# EAGLE board 8ModuleBoard_vr2 (EAGLE 6.3)
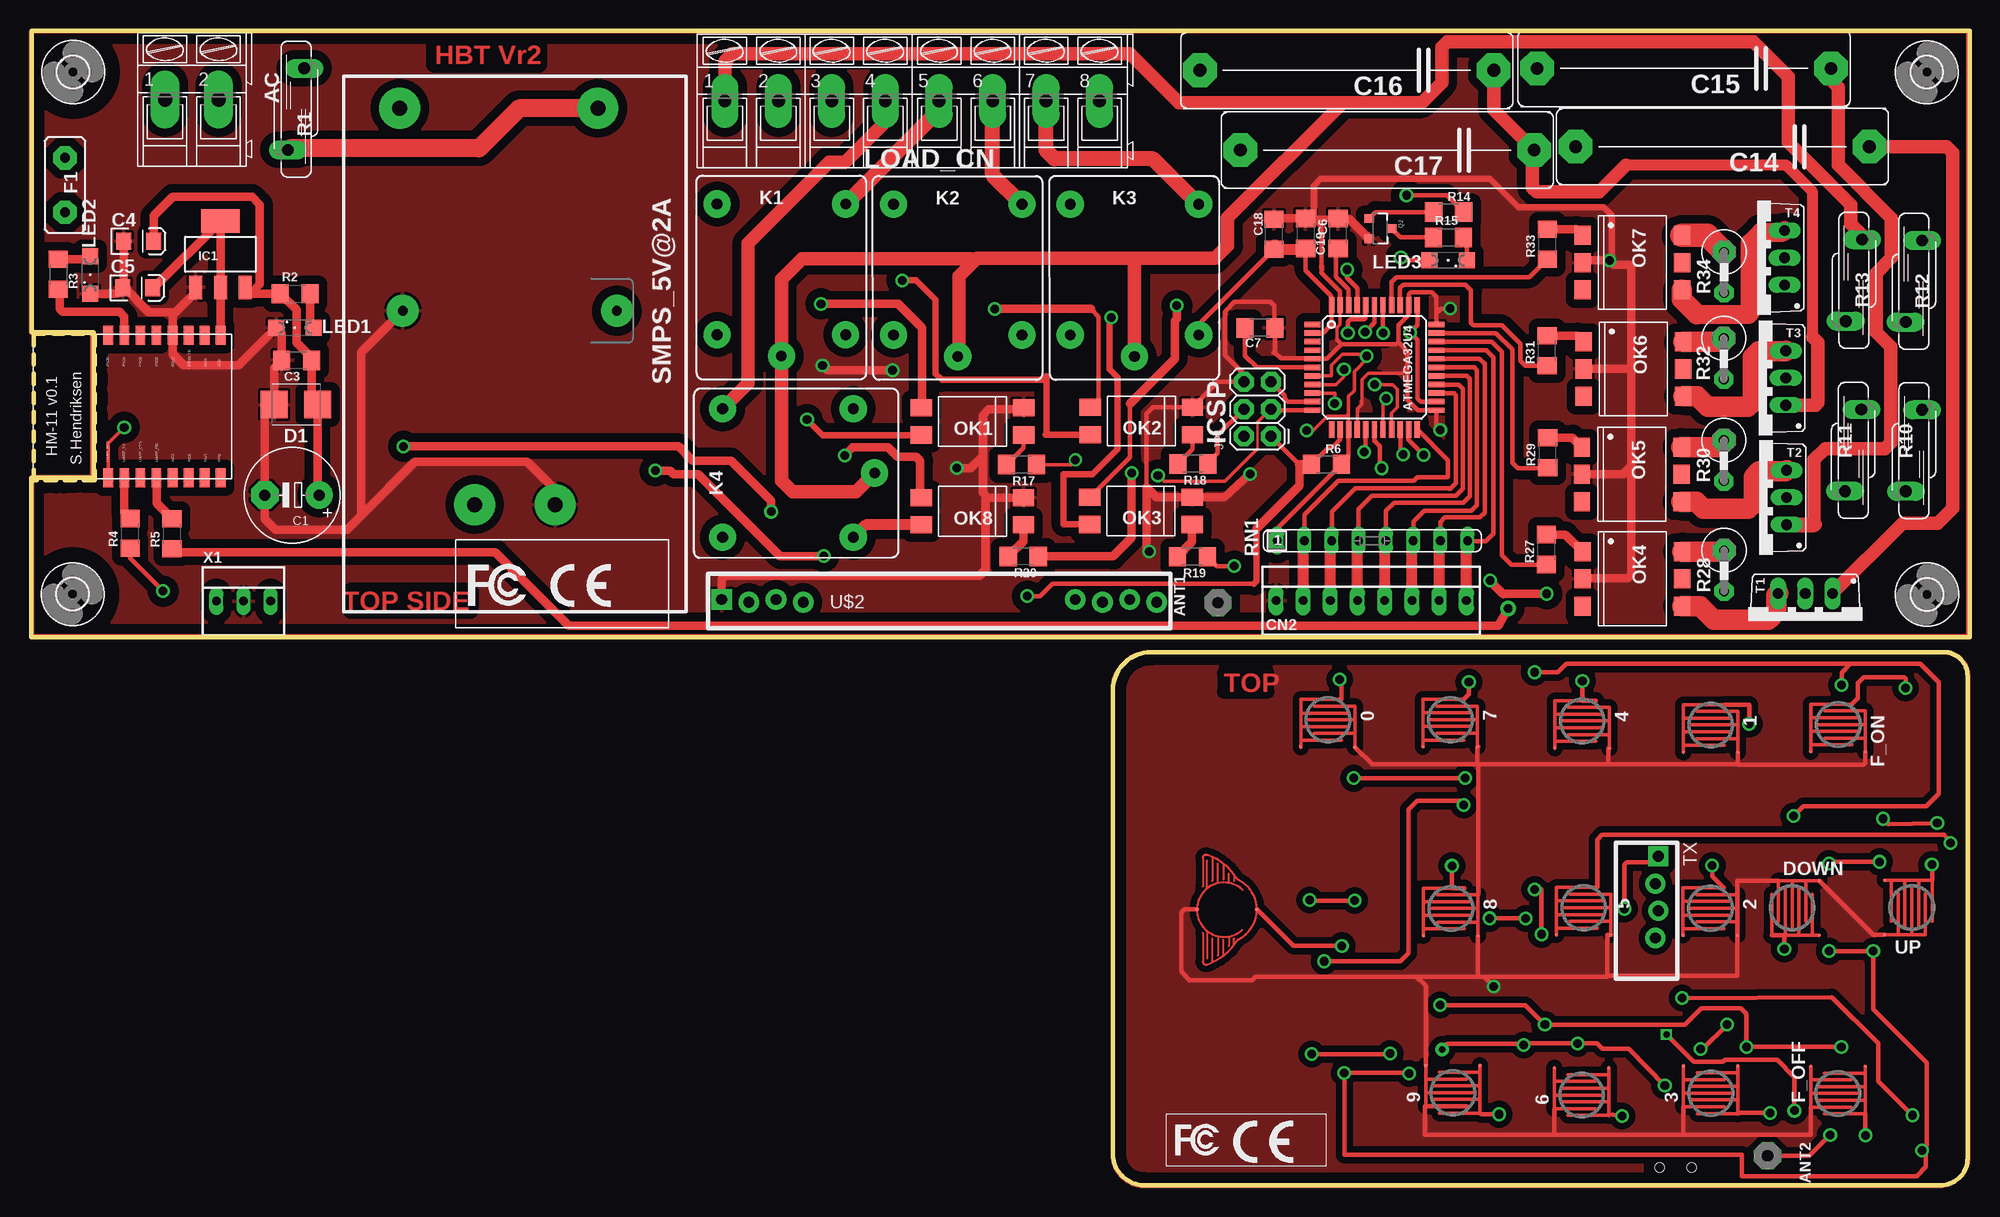
[diagram p5: board, top side]
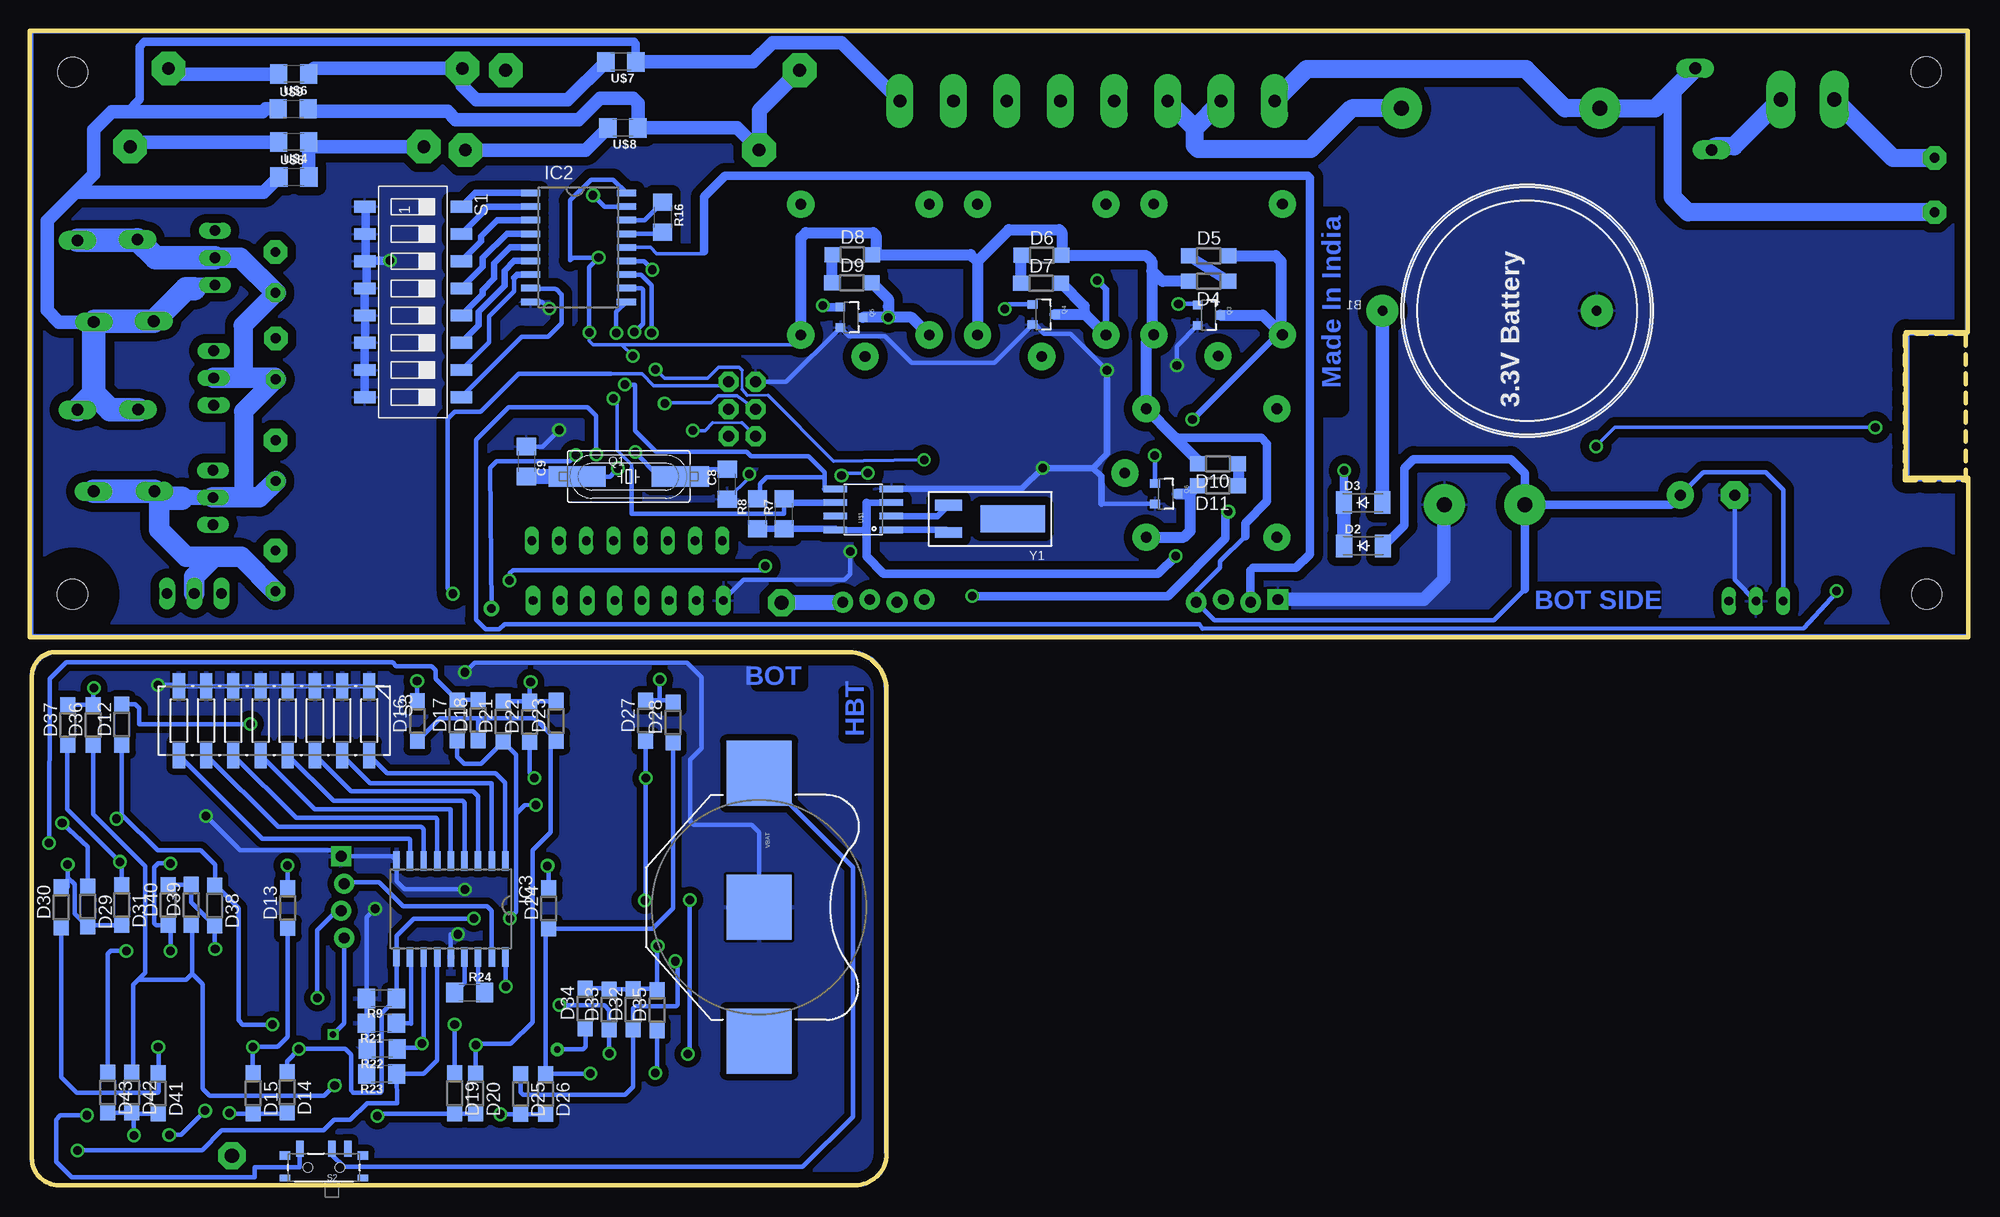
[diagram p6: board, bottom side, seen from below]

Size 180.99 x 107.79 mm. Coordinates in mm from the lower left corner, seen from the top.
Outline: 5.91,79.34 5.91,65.83 0.22,65.79 0.22,79.49 5.83,79.49
Outline: 0.06,107.79 180.99,107.79 180.99,51.15 0,51.15 0,66.04 5.81,66.04 5.81,79.64 0.02,79.64 0.02,107.77
Outline: 178.53,49.75 104.54,49.75 arc90 100.99,46.21 100.99,2.93 arc90 103.93,0 178.3,0 arc90 180.81,2.51 180.81,47.54 arc90 178.58,49.77
Copper layers (1*16): Top 0.035mm / dielectric 1.5mm / Bottom 0.035mm
Design rules "default": minimum track width 10mil, minimum drill 24mil, track to track 8mil, track to pad 8mil, pad to pad 8mil, via to via 8mil, smd to smd 8mil, copper to edge 40mil, drill to drill 8mil, minimum pad ring 10mil, minimum via ring 8mil, stop-mask expansion 4mil, vias tented up to drill 0mil, thermal gap 10mil

## Footprints (pad centres in the part's own frame; a part is rotated, then mirrored left to right if it is on the bottom)
BUTTON-CONDUCTIVE = smd 0.203 x 0.203: 1 2.54,2.54; 2 2.54,-2.54
AK300/2 = drill 1.321 pad 2.7 long: 1 -2.515,0; 2 2.489,0
PAD-01 = drill 1.321 pad 2.54 octagon: 1 0,0
TQFP44 = smd 1.5 x 0.5: 1 -5.8,4; 2 -5.8,3.2; 3 -5.8,2.4; 4 -5.8,1.6; 5 -5.8,0.8; 6 -5.8,0; 7 -5.8,-0.8; 8 -5.8,-1.6; 9 -5.8,-2.4; 10 -5.8,-3.2; 11 -5.8,-4; 23 5.8,-4; 24 5.8,-3.2; 25 5.8,-2.4; 26 5.8,-1.6; 27 5.8,-0.8; 28 5.8,0; 29 5.8,0.8; 30 5.8,1.6; 31 5.8,2.4; 32 5.8,3.2; 33 5.8,4 | smd 0.5 x 1.5: 12 -4,-5.8; 13 -3.2,-5.8; 14 -2.4,-5.8; 15 -1.6,-5.8; 16 -0.8,-5.8; 17 0,-5.8; 18 0.8,-5.8; 19 1.6,-5.8; 20 2.4,-5.8; 21 3.2,-5.8; 22 4,-5.8; 34 4,5.8; 35 3.2,5.8; 36 2.4,5.8; 37 1.6,5.8; 38 0.8,5.8; 39 0,5.8; 40 -0.8,5.8; 41 -1.6,5.8; 42 -2.4,5.8; 43 -3.2,5.8; 44 -4,5.8
CR2032 = drill 0.9 pad 3: + 10,0; - -10,0
E5-8,5 = drill 1.016 pad 2.54: + -2.54,0 | drill 1.016 pad 2.54 octagon: - 2.54,0
1206 = smd 1.6 x 1.8: 1 -1.4,0; 2 1.4,0
EIA3216 = smd 1.4 x 1.6: A 1.4,0; C -1.4,0
C27.5B9 = drill 1.194 pad 3.15 octagon: 1 -13.716,0; 2 13.716,0
22-23-2081 = drill 0.8 pad 1.422 long: 1 -8.89,0; 2 -6.35,0; 3 -3.81,0; 4 -1.27,0; 5 1.27,0; 6 3.81,0; 7 6.35,0; 8 8.89,0
SMBJ = smd 2.54 x 2.54: A 2.04,0; C -2.03,0
SOD-123_MINI-SMA = smd 1.5 x 2.1: A 1.8,0; C -1.8,0
SOD123 = smd 1.4 x 1.4: A 1.9,0; C -1.9,0
MF-5,1B = drill 0.914 pad 2.184 octagon: 1 -2.54,0; 2 2.54,0
2,8 = hole 2.8: 0,0
SOT223 = smd 1.219 x 2.235: 1 -2.311,-3.099; 2 0,-3.099; 3 2.311,-3.099 | smd 3.6 x 2.2: 4 0,3.099
SOP18 = smd 0.6 x 1.8: 1 -5.08,-4.475; 2 -3.81,-4.475; 3 -2.54,-4.475; 4 -1.27,-4.475; 5 0,-4.475; 6 1.27,-4.475; 7 2.54,-4.475; 8 3.81,-4.475; 9 5.08,-4.475; 10 5.08,4.475; 11 3.81,4.5; 12 2.54,4.5; 13 1.27,4.5; 14 0,4.5; 15 -1.27,4.5; 16 -2.54,4.5; 17 -3.81,4.5; 18 -5.08,4.5
2X3 = drill 1.016 pad 1.88 octagon: 1 0,0; 2 0,2.54; 3 2.54,0; 4 2.54,2.54; 5 5.08,0; 6 5.08,2.54
JS-M = drill 1 pad 2.54: 1 6.7,6; 2 6.7,-6; C 8.7,0; NC -5.5,-6; NO -5.5,6
SML1206 = smd 1.5 x 1.5: A 1.75,0; C -1.75,0
AK300/8 = drill 1.2 pad 2.54 long: 1 -17.501,0; 2 -12.497,0; 3 -7.518,0; 4 -2.515,0; 5 2.515,0; 6 7.518,0; 7 12.497,0; 8 17.501,0
BUTTON-CONDUCTIVE-MINI = smd 0.254 x 0.254: 1 5.08,-0.559; 2 5.08,5.055
DIL4-SMD = smd 1.6 x 2: 1 -1.27,-4.77; 2 1.27,-4.77; 3 1.27,4.77; 4 -1.27,4.77
DIL6-SMD = smd 1.78 x 1.52: 1 -2.54,-4.645; 2 0,-4.645; 3 2.54,-4.645; 4 2.54,4.645; 5 0,4.645; 6 -2.54,4.645
HC49UP = smd 5.334 x 1.93: 1 -4.826,0; 2 4.826,0
SOT23-3 = smd 0.8 x 0.9: 1 -0.95,-1; 2 0.95,-1; 3 0,1.1
S10K11 = drill 1.1 pad 1.778 long: 1 -0.762,-3.81; 2 0.762,3.81
0411V = drill 0.914 pad 2.184 octagon: 1 -2.54,0 | drill 0.914 pad 1.778 octagon: 2 1.27,0
SIL8 = drill 0.813 long: 1 -8.89,0; 2 -6.35,0; 3 -3.81,0; 4 -1.27,0; 5 1.27,0; 6 3.81,0; 7 6.35,0; 8 8.89,0
SMS-008 = smd 1.092 x 2.007: 1 -8.89,-4.496; 2 -6.35,-4.496; 3 -3.81,-4.496; 4 -1.27,-4.496; 5 1.27,-4.496; 6 3.81,-4.496; 7 6.35,-4.496; 8 8.89,-4.496; 9 8.89,4.496; 10 6.35,4.496; 11 3.81,4.496; 12 1.27,4.496; 13 -1.27,4.496; 14 -3.81,4.496; 15 -6.35,4.496; 16 -8.89,4.496
SWITCH-SPST-SMD-A = smd 0.7 x 1.5: 1 -2.25,-1.75; 2 -0.75,-1.75; 3 2.25,-1.75 | smd 1 x 0.6: GND1 -3.65,1; GND3 3.65,1 | smd 1 x 0.8: GND2 -3.65,-1.1; GND4 3.65,-1.1 | hole 0.9: -1.5,0; 1.5,0
CTS-219-08J = smd 1.13 x 2.44: 1 -8.89,-3.215; 2 -6.35,-3.215; 3 -3.81,-3.215; 4 -1.27,-3.215; 5 1.27,-3.215; 6 3.81,-3.215; 7 6.35,-3.215; 8 8.89,-3.215; 9 8.89,3.215; 10 6.35,3.215; 11 3.81,3.215; 12 1.27,3.215; 13 -1.27,3.215; 14 -3.81,3.215; 15 -6.35,3.215; 16 -8.89,3.215
MKS1854-6-0-404 = drill 1.4 pad 3.81: 1 5.25,47; 2 23.75,47; 3 12.25,10; 4 19.75,10
TO220BV = drill 1 pad 1.422 long: G 2.54,-2.54; T1 -2.54,-2.54; T2 0,-2.54
RF-LINK_TX = drill 1.016 pad 1.88: ANT 7.62,-0.127; DATA 2.54,-0.127; VCC 5.08,0.127 | drill 1.016 pad 1.88 square: GND 0,0.127
SO08 = smd 0.61 x 2.21: 1 -1.905,-2.616; 2 -0.635,-2.616; 3 0.635,-2.616; 4 1.905,-2.616; 5 1.905,2.616; 6 0.635,2.616; 7 -0.635,2.616; 8 -1.905,2.616
RF-LINK_RX = drill 1 pad 1.93: +5V@1 7.62,-0.127; +5V@2 33.02,0.127; ANT 40.64,-0.127; DATA@1 2.54,-0.127; DATA@2 5.08,0.127; GND@2 35.56,-0.127; GND@3 38.1,0.127 | drill 1 pad 1.93 square: GND@1 0,0.127
HM-11 = smd 1.778 x 0.914: GND 7.508,-0.6; NC1 -5.808,-0.6; NC2 -5.808,-2.1; NC3 7.508,-3.6; NV1 -5.808,-3.6; NV2 -5.808,-5.1; PIO0 7.508,5.4; PIO1 7.508,3.9; PIO2 7.508,2.4; PIO3 7.508,0.9; RESETB 7.508,-2.1; UART_CTS -5.808,2.4; UART_RTS -5.808,5.4; UART_RX -5.808,0.9; UART_TX -5.808,3.9; VCC 7.508,-5.1
BATTCON_20MM = smd 6.07 x 6.07: 1 -12.5,0; 2 0,0; 3 12.5,0
22-23-2031 = drill 0.8 pad 1.27 long: 1 -2.54,0; 2 0,0; 3 2.54,0
CRYSTAL_CYL_2X6MM_SMT = smd 2.5 x 1: 1 2.125,1.27; 2 2.125,-1.27 | smd 6 x 2.5: CYLINDER -3.875,0

## Placement (x,y rotation side)
0  BUTTON-CONDUCTIVESMD  [BUTTON-CONDUCTIVE]  121.07,43.45 270 top
1  BUTTON-CONDUCTIVESMD  [BUTTON-CONDUCTIVE]  156.8,42.97 270 top
2  BUTTON-CONDUCTIVESMD  [BUTTON-CONDUCTIVE]  156.77,25.86 270 top
3  BUTTON-CONDUCTIVESMD  [BUTTON-CONDUCTIVE]  156.82,8.59 90 top
4  BUTTON-CONDUCTIVESMD  [BUTTON-CONDUCTIVE]  144.82,43.34 270 top
5  BUTTON-CONDUCTIVESMD  [BUTTON-CONDUCTIVE]  144.95,25.9 270 top
6  BUTTON-CONDUCTIVESMD  [BUTTON-CONDUCTIVE]  144.76,8.41 90 top
7  BUTTON-CONDUCTIVESMD  [BUTTON-CONDUCTIVE]  132.5,43.46 270 top
8  BUTTON-CONDUCTIVESMD  [BUTTON-CONDUCTIVE]  132.54,25.84 270 top
9  BUTTON-CONDUCTIVESMD  [BUTTON-CONDUCTIVE]  132.75,8.64 90 top
AC  [AK300/2]  14.99,101.36 0 top
ANT1  [PAD-01]  110.81,54.38 90 top
ANT2  [PAD-01]  162.12,2.74 270 top
ATMEGA32U4  ATMEGA32U4TQFP-44  [TQFP44]  125.41,76.35 0 top
B1  [CR2032]  44.68,81.64 0 top
C1  470uF/25V  [E5-8,5]  24.34,64.43 180 top
C3  0.1uF  [1206]  24.76,77 180 top
C4  10uF  [EIA3216]  10,88.12 0 top
C5  10uF  [EIA3216]  9.92,83.77 0 top
C6  0.1uF  [1206]  122.03,88.85 90 top
C7  1uF  [1206]  114.71,80.03 180 top
C8  18pF  [1206]  115.87,65.45 90 bottom
C9  18pF  [1206]  134.64,67.56 270 bottom
C14  2.2uF/250VAC  [C27.5B9]  157.92,96.96 180 top
C15  3.3uF/250VAC  [C27.5B9]  154.33,104.26 180 top
C16  2.2uF/250VAC  [C27.5B9]  122.84,104.09 180 top
C17  3.3uF/250VAC  [C27.5B9]  126.62,96.64 180 top
C18  0.1uF  [1206]  116.02,88.77 90 top
C19  0.1uF  [1206]  118.98,88.85 270 top
CN2  Capsense I/P  [22-23-2081]  125.11,54.58 0 top
D1  [SMBJ]  24.72,72.88 180 top
D2  CGRM4007-G  [SOD-123_MINI-SMA]  56.46,59.69 0 bottom
D3  CGRM4007-G  [SOD-123_MINI-SMA]  56.51,63.73 0 bottom
D4  [SOD123]  70.92,84.38 180 bottom
D5  [SOD123]  70.92,86.79 0 bottom
D6  [SOD123]  86.52,86.81 0 bottom
D7  [SOD123]  86.57,84.2 0 bottom
D8  [SOD123]  104.2,86.88 0 bottom
D9  [SOD123]  104.24,84.24 0 bottom
D10  [SOD123]  70.05,67.37 180 bottom
D11  [SOD123]  70.06,65.3 180 bottom
D12  [SOD123]  172.4,42.99 90 bottom
D13  [SOD123]  156.91,25.87 90 bottom
D14  [SOD123]  156.99,8.68 270 bottom
D15  [SOD123]  160.13,8.59 270 bottom
D16  [SOD123]  144.81,43.35 90 bottom
D17  [SOD123]  141.1,43.38 90 bottom
D18  [SOD123]  139.13,43.41 90 bottom
D19  [SOD123]  141.34,8.58 270 bottom
D20  [SOD123]  139.35,8.56 270 bottom
D21  [SOD123]  136.79,43.29 90 bottom
D22  [SOD123]  134.34,43.26 90 bottom
D23  [SOD123]  131.85,43.35 90 bottom
D24  [SOD123]  132.53,25.85 90 bottom
D25  [SOD123]  135.19,8.51 270 bottom
D26  [SOD123]  132.85,8.52 270 bottom
D27  [SOD123]  123.5,43.37 90 bottom
D28  [SOD123]  120.95,43.2 90 bottom
D29  [SOD123]  175.59,26.02 270 bottom
D30  [SOD123]  178.06,25.95 90 bottom
D31  [SOD123]  172.42,26.16 270 bottom
D32  [SOD123]  124.66,16.42 90 bottom
D33  [SOD123]  126.89,16.4 90 bottom
D34  [SOD123]  129.16,16.49 90 bottom
D35  [SOD123]  122.44,16.34 90 bottom
D36  [SOD123]  175.09,42.95 90 bottom
D37  [SOD123]  177.44,42.95 90 bottom
D38  [SOD123]  163.74,26.12 270 bottom
D39  [SOD123]  165.95,26.17 90 bottom
D40  [SOD123]  168.07,26.15 90 bottom
D41  [SOD123]  168.99,8.58 270 bottom
D42  [SOD123]  171.47,8.67 270 bottom
D43  [SOD123]  173.71,8.67 270 bottom
DOWN  BUTTON-CONDUCTIVESMD  [BUTTON-CONDUCTIVE]  164.42,25.89 0 top
F1  PFUSE 1A  [MF-5,1B]  3.13,93.37 90 top
F_OFF  BUTTON-CONDUCTIVESMD  [BUTTON-CONDUCTIVE]  168.69,8.56 90 top
F_ON  BUTTON-CONDUCTIVESMD  [BUTTON-CONDUCTIVE]  168.72,43.01 270 top
H1  MOUNT-HOLE2.8  [2,8]  3.89,103.93 0 top
H2  MOUNT-HOLE2.8  [2,8]  3.85,55.18 0 top
H3  MOUNT-HOLE2.8  [2,8]  177,103.91 0 top
H4  MOUNT-HOLE2.8  [2,8]  177.02,55.15 0 top
IC1  [SOT223]  17.66,86.91 0 top
IC2  HT680D  [SOP18]  129.77,87.55 270 bottom
IC3  HT680D  [SOP18]  141.68,25.8 180 bottom
JP1  AVR_SPI_PRG_6PTH  [2X3]  115.76,69.92 90 top
K1  JS-M1-9V-4  [JS-M]  70.04,86.1 270 top
K2  JS-M1-9V-4  [JS-M]  86.5,86.07 270 top
K3  JS-M1-9V-4  [JS-M]  103,86.07 270 top
K4  JS-M1-9V-4  [JS-M]  70.05,66.49 0 top
LED1  [SML1206]  24.6,80.05 0 top
LED2  [SML1206]  5.49,84.99 90 top
LED3  [SML1206]  132.3,86.34 180 top
LOAD_CN  [AK300/8]  82.25,101.22 0 top
MASTER  BUTTON-CONDUCTIVE  [BUTTON-CONDUCTIVE-MINI]  109.4,30.83 270 top
OK1  PC817DIL4  [DIL4-SMD]  87.88,71.3 90 top
OK2  PC817DIL4  [DIL4-SMD]  103.65,71.35 90 top
OK3  PC817DIL4  [DIL4-SMD]  103.61,62.96 90 top
OK4  MOC3031S  [DIL6-SMD]  149.51,56.6 270 top
OK5  MOC3031S  [DIL6-SMD]  149.44,66.36 270 top
OK6  MOC3031S  [DIL6-SMD]  149.6,76.2 270 top
OK7  MOC3031S  [DIL6-SMD]  149.49,86.13 270 top
OK8  PC817DIL4  [DIL4-SMD]  87.87,62.92 90 top
Q1  16MHz  [HC49UP]  125.08,66.16 0 bottom
Q2  MMBT2222A  [SOT23-3]  125.92,89.31 270 top
Q3  MMBT2222A  [SOT23-3]  70.95,81.22 270 bottom
Q4  MMBT2222A  [SOT23-3]  86.37,81.29 270 bottom
Q5  MMBT2222A  [SOT23-3]  104.31,81.02 270 bottom
Q6  MMBT2222A  [SOT23-3]  74.93,64.55 270 bottom
R1  MOV300V  [S10K11]  24.72,100.46 0 top
R2  1K  [1206]  24.64,83.22 0 top
R3  1K  [1206]  2.51,85.03 270 top
R4  1K  [1206]  9.22,60.85 90 top
R5  1K  [1206]  13.13,60.81 90 top
R6  10K  [1206]  120.94,67.31 0 top
R7  4k7  [1206]  110.57,62.69 90 bottom
R8  4k7  [1206]  113.04,62.69 90 bottom
R9  1K  [1206]  148.17,17.43 180 bottom
R10  S10K11  [S10K11]  175.8,68.58 180 top
R11  S10K11  [S10K11]  170.13,68.6 180 top
R12  S10K11  [S10K11]  175.79,84.39 0 top
R13  S10K11  [S10K11]  170.19,84.48 0 top
R14  10K  [1206]  132.35,90.85 0 top
R15  560R  [1206]  132.33,88.49 0 top
R16  33k  [1206]  121.91,90.36 270 bottom
R17  1K  [1206]  92.46,67.27 180 top
R18  1K  [1206]  108.46,67.34 180 top
R19  1K  [1206]  108.41,58.67 180 top
R20  1K  [1206]  92.61,58.7 180 top
R21  1K  [1206]  148.16,15.11 180 bottom
R22  1K  [1206]  148.11,12.72 180 bottom
R23  1K  [1206]  148.14,10.38 180 bottom
R24  750K  [1206]  139.93,17.99 0 bottom
R27  560R  [1206]  141.48,59.34 90 top
R28  470R/0.5W  [0411V]  158.07,56.72 270 top
R29  560R  [1206]  141.59,68.39 90 top
R30  470R/0.5W  [0411V]  158.05,67.01 270 top
R31  560R  [1206]  141.53,77.91 90 top
R32  470R/0.5W  [0411V]  158.03,76.52 270 top
R33  560R  [1206]  141.57,87.86 90 top
R34  470R/0.5W  [0411V]  158.06,84.58 270 top
RN1  [SIL8]  125.22,60.17 0 top
S1  SWS008  [SMS-008]  145.22,82.45 270 bottom
S2  [SWITCH-SPST-SMD-A]  153.54,1.65 180 bottom
S3  219-08J  [CTS-219-08J]  158.19,43.37 180 bottom
SMPS_5V@2A  5V@2A  [MKS1854-6-0-404]  29.15,53.54 0 top
T1  BTB16-V  [TO220BV]  165.65,52.71 180 top
T2  BTB16-V  [TO220BV]  161.36,64.2 90 top
T3  BTB16-V  [TO220BV]  161.29,75.36 90 top
T4  BTB16-V  [TO220BV]  161.18,86.58 90 top
TX  RF-LINK_TX  [RF-LINK_TX]  151.79,30.7 270 top
U$1  DS1307SO8  [SO08]  103.16,63.09 90 bottom
U$2  RF-LINK_RX  [RF-LINK_RX]  64.46,54.55 0 top
U$3  HM-11  [HM-11]  12.58,71.85 90 top
U$4  220K  [1206]  156.37,97.39 180 bottom
U$5  2E2  [1206]  156.34,94.14 0 bottom
U$6  220K  [1206]  156.35,103.74 180 bottom
U$7  2E2  [1206]  125.81,104.87 180 bottom
U$8  220K  [1206]  125.62,98.7 180 bottom
U$9  2E2  [1206]  156.4,100.5 0 bottom
U$10  [CE-4MM]  112.22,2.03 0 top
U$11  [FCC_6.1X15MM]  105.92,1.71 0 top
U$12  [FCC_20X8.35MM]  39.57,52 0 top
U$13  [CE-4MM]  48.46,53.96 0 top
UP  BUTTON-CONDUCTIVESMD  [BUTTON-CONDUCTIVE]  175.59,25.92 180 top
VBAT  [BATTCON_20MM]  112.9,25.95 270 bottom
X1  22-23-2031  [22-23-2031]  19.8,54.52 0 top
Y1  32.768KHz  [CRYSTAL_CYL_2X6MM_SMT]  93.08,62.21 180 bottom

## Tracks (layer width: path | path; a pad name or v marks a point on that pad's centre or on a via)
!RESET  (via drill 0.8 pad 1.27)
  Top 0.305: 115.75,69.9 118.43,67.22 | v8.66,70.74 7.18,69.26 U$3.UART_RTS
  Top 0.406: 115.75,69.9 JP1.1 118.38,67.31 | ATMEGA32U4.13 122.21,69.59 121.57,68.96 121.19,68.96 R6.1 | 114.18,56.17 95.36,56.17 94.19,55 v93,55
  Top 0.61: 114.4,61.28 114.4,56.39 114.18,56.17
  Top 0.813: R6.1 118.38,67.31 | 118.43,67.22 118.43,65.31 114.4,61.28 | v34.75,68.97 60.45,68.97 61.76,67.66 65.32,67.66 69.07,63.9 v69.07,62.88
  Bottom 0.305: v34.75,68.97 32.97,70.74 v8.66,70.74
  Bottom 0.813: v93,55 77.97,55 74.73,55 69.34,60.39 69.34,62.61 v69.07,62.88
(DIN)TE
  Bottom 0.305: IC2.14 123.06,87.55 122.48,86.98 118.23,86.98 118.05,87.17 | 61.63,94.24 61.46,94.07 | 66.8,57.63 67.02,57.41 | 67.02,54.45 U$2.DATA@1
  Bottom 0.813: 118.05,87.17 118.05,92.27 116.07,94.24 61.63,94.24 | 61.46,94.07 61.46,58.92 62.75,57.63 66.8,57.63 | 67.02,57.41 67.02,54.45
(VT)ADOUT  (via drill 0.8 pad 1.27)
  Top 0.406: R14.2 132.18,92.42 v128.41,92.42
  Bottom 0.406: v128.41,92.42 127.35,91.36 IC2.17
+3V3
  Top 0.813: U$3.VCC 17.66,79.38 IC1.2 IC1.4 11.43,83.77 C5.A
+5V  (via drill 0.8 pad 1.27)
  Top 0.305: ATMEGA32U4.7 121.39,75.55 121.39,76.56 122.41,77.58 124.54,77.58 v124.68,77.43 124.83,77.29 124.87,77.29 123.55,75.96 123.55,74.18 123.01,73.64 123.01,71.05 123.01,71.06 123.01,72 122.81,71.8 121.02,71.8 119.66,70.44 v119.1,70.44
  Top 0.406: 131.4,73.21 131.35,73.15 ATMEGA32U4.24 129.73,73.15 129.44,73.45 129.44,78.95 v128.76,79.62 129.41,80.27 ATMEGA32U4.34 | v127.89,86.6 128.15,86.34 LED3.A | C19.2 118.98,85.42 121.41,82.99 ATMEGA32U4.44 121.41,80.36 120.6,79.55 ATMEGA32U4.2 | RN1.1 116.33,61.3 R6.2 123.01,67.97 ATMEGA32U4.14 123.01,71.05 | C18.1 109,80.35 K3.1
  Top 0.813: 20.5,83.28 20.56,83.22 R2.1 24.75,81.71 24.75,78.65 26.16,77.24 C3.1 26.16,73.47 D1.C 26.75,64.56 C1.+ | 20.5,83.28 IC1.3 | C4.A 11.4,90.48 13.18,92.26 20.61,92.26 21.33,91.54 21.33,84.11 20.5,83.28
  Top 1.016: C18.1 118.9,87.37 C19.2
  Top 1.27: C18.1 116.13,87.48 116.13,87.67
  Bottom 0.254: 114.54,71.2 117.23,71.2
  Bottom 0.305: K3.1 109.67,78.71 arc90 109.9,78.47 125.73,78.47 | v128.76,79.62 128.76,78.83 128.41,78.47 125.73,78.47 | JP1.2 114.49,71.2 114.54,71.2 | 117.23,71.2 117.94,70.44 v119.1,70.44 | 125.73,78.47 v124.68,77.43
  Bottom 0.406: IC2.18 126.52,93.88 128.6,93.88 130.55,91.93 LED3.A 130.29,86.6 v127.89,86.6 128.76,85.72 v128.76,79.62 | X1.1 17.26,64.94 18.9,66.58 24.73,66.58 C1.+ | 41.4,55.63 44.3,52.73 70.38,52.73 U$2.+5V@1 72.08,55.44 69.87,57.64 69.87,58.23 67.51,60.6
  Bottom 0.61: D2.A 54.54,59.81 54.45,59.81
  Bottom 0.813: 41.4,55.63 SMPS_5V@2A.3 | 54.45,59.81 52.63,61.62 52.63,66.94 51.79,67.79 42.7,67.79 41.4,66.48 SMPS_5V@2A.3 | 74.05,69.79 66.01,69.79 65.45,69.24 65.45,63.85 67.51,61.79 67.51,60.6 | C1.+ 27.77,63.54 SMPS_5V@2A.3
  Bottom 1.016: D10.A 71.95,67.7 74.05,69.79 K4.1 76.75,78.7 K1.1 76.21,79.58 76.21,85.36 | D8.A 101.78,86.88 | K3.1 109,88.46 108.54,88.93 102.23,88.93 102,88.7 102,87.11 101.78,86.88 | 76.21,85.36 76.21,86.24 76.79,86.81 D6.A 84.62,88.97 84.87,89.21 89.58,89.21 92.53,86.27 | 101.78,86.88 93.14,86.88 92.53,86.27 | 92.53,86.27 92.53,79.39 K2.1 | D4.A 75.23,84.38 76.21,85.36
A0
  Bottom 0.61: IC2.1 139.43,92.63 S1.16
A1
  Bottom 0.61: IC2.2 138.27,91.36 138.87,90.76 138.87,90.66 S1.15
A2
  Bottom 0.61: IC2.3 137.34,90.09 138.85,88.58 138.85,88.13 S1.14
A3
  Bottom 0.61: IC2.4 136.44,88.82 138.69,86.57 138.69,85.75 S1.13
A4
  Bottom 0.61: IC2.5 136.14,87.55 137.64,86.06 137.64,84.65 138.73,83.56 138.73,83.17 S1.12
A5
  Bottom 0.61: IC2.6 135.77,86.28 136.67,85.38 136.67,83.95 139.07,81.55 139.07,80.3 S1.11
A6
  Bottom 0.406: 135.78,84.73 135.78,83.47 138.11,81.14 138.11,78.72 S1.10
  Bottom 0.61: IC2.7 135.5,85.01 135.78,84.73
A7
  Bottom 0.406: IC2.8 134.24,83.68 134.24,83.67 131.95,83.67 131.9,83.63 131.83,83.63 131.39,83.19 131.36,83.19 131.36,80.47 132.61,79.21 135.07,79.21 S1.9
BLE_STATUS
  Top 0.813: U$3.PIO1 8.68,81.09 8.25,81.52 2.93,81.52 2.64,81.81 2.64,83.5 R3.2
D8  (via drill 0.8 pad 1.27)
  Top 0.406: v126.22,79.57 v126.21,79.57 ATMEGA32U4.38
  Bottom 0.406: IC2.10 126.24,81.52 126.24,79.59 v126.22,79.57
D9  (via drill 0.8 pad 1.27)
  Top 0.406: v124.55,79.64 125.41,80.5 ATMEGA32U4.39
  Bottom 0.406: IC2.11 123.88,83.74 123.76,83.62 123.76,80.44 v124.55,79.64
D10  (via drill 0.8 pad 1.27)
  Top 0.406: v122.94,79.57 122.94,80.59 123.18,80.83 124.48,80.83 124.57,80.92 124.57,82.11 ATMEGA32U4.40
  Bottom 0.406: IC2.12 123.93,85.01 122.92,84 122.92,79.59 v122.94,79.57
D11  (via drill 0.8 pad 1.27)
  Top 0.406: v122.85,85.46 122.85,84.71 123.8,83.76 ATMEGA32U4.41
  Bottom 0.406: 125.35,86.37 IC2.13 125.16,86.28 125.13,86.25 123.64,86.25 v122.85,85.46 | 125.35,86.37
DOWN
  Top 0.406: ATMEGA32U4.29 135.24,77.15 135.71,76.68 135.71,62.79 135.27,62.35 132.02,62.35 131.58,61.91 RN1.7
  Top 1.016: CN2.7 131.46,60.07 RN1.7
EA0
  Bottom 0.406: S3.16 147.62,38.47 137.49,38.47 136.6,37.58 IC3.1
EA1
  Bottom 0.406: S3.15 149.23,37.55 137.91,37.55 137.87,37.51 IC3.2
EA2
  Bottom 0.406: S3.14 151,36.77 139.6,36.77 139.14,36.32 IC3.3
EA3
  Bottom 0.406: S3.13 152.65,35.89 140.59,35.89 140.41,35.71 IC3.4
EA4
  Bottom 0.406: S3.12 154.39,35.08 141.7,35.08 141.68,35.06 IC3.5
EA5
  Bottom 0.406: S3.11 156.14,34.3 143.07,34.3 142.95,34.18 IC3.6
EA6
  Bottom 0.406: S3.10 157.83,33.44 144.45,33.44 144.22,33.22 IC3.7
EA7
  Bottom 0.406: S3.9 159.29,32.36 145.6,32.36 145.49,32.26 IC3.8
EAD8  (via drill 0.8 pad 1.27)
  Top 0.406: v158.35,14.99 156.08,12.72 v155.86,12.72 | v136.18,24.92 139.51,24.92 v139.54,24.89 | v120.73,20.91 127.83,20.91 128.57,21.64 128.57,35.04 129.41,35.88 133.58,35.88 v133.75,35.51 | v177.97,33.8 173.42,33.69 v172.9,34.21
  Bottom 0.406: D12.C 172.4,34.59 | 172.4,34.59 169.07,31.26 165.05,31.26 163.71,29.92 163.71,28.06 | 163.71,28.06 D38.C | D25.C 135.15,10.37 135.15,8.65 134.93,8.44 125.42,8.44 124.66,9.2 D32.C 124.66,16.5 124.46,16.71 120.65,16.71 120.52,16.84 120.52,20.69 v120.73,20.91 | D17.C 141.1,40 140.44,39.34 138.85,39.34 D21.C 135.58,40.18 135.58,34.69 | 163.71,28.06 161.49,25.84 161.49,15.38 161.1,14.99 v158.35,14.99 | D14.C 156.99,11.59 v155.86,12.72 151.57,12.72 151.02,12.16 151.02,8.86 150.81,8.65 148.25,8.65 148.13,8.77 148.13,16.07 R9.1 IC3.10 146.76,23.3 145.18,24.89 v139.54,24.89 | 135.58,34.69 135.58,25.51 v136.18,24.92 | v133.75,35.51 134.81,35.47 135.58,34.69 | D29.C 175.59,31.6 v177.97,33.8 | v172.9,34.21 172.78,34.21 172.4,34.59
EAD9
  Bottom 0.406: IC3.11 arc90 145.39,21.19 145.39,15.08 arc-90 145.41,15.11 R21.1
EAD10  (via drill 0.6 pad 1.27, 0.8 pad 1.27)
  Top 0.406: v131.72,12.67 132.24,13.19 139.25,13.19 v139.35,13.08 139.51,13.24 v144.4,13.24 146.19,13.24 R22.1 149.19,12.72 v152.53,9.29
  Bottom 0.406: D36.C 175.09,34.63 170.24,29.77 170.24,19.84 170.88,19.2 | D39.C 165.86,24.18 165.86,19.73 | D42.C 171.47,10.71 171.36,10.83 171.36,18.72 170.88,19.2 | 165.86,19.73 166.39,19.2 170.88,19.2 | D20.C v139.35,13.08 139.25,13.19 136.09,13.19 134.04,15.23 134.04,31.29 132.36,32.97 132.36,40.94 D23.C 131.85,41.57 133.92,43.64 133.92,43.62 133.96,43.57 138.89,43.57 | v131.72,12.67 129.35,12.67 129.1,12.93 129.1,14.53 D34.C | 138.89,43.57 139.13,43.33 D18.C | D16.C 142.68,43.57 138.89,43.57 | IC3.12 144.22,13.41 v144.4,13.24 144.82,12.82 146.61,12.82 R22.1 | 165.86,19.73 164.87,18.74 164.87,9.01 164.2,8.35 153.52,8.35 152.18,9.69 v152.53,9.29
EAD11  (via drill 0.8 pad 1.27)
  Top 0.406: v172.59,30.19 168,30.19 v167.85,30.04 | v167.85,21.85 v172,21.85 172,16.45 177.01,11.44 177.01,3.69 176.92,3.61 | v128.66,10.42 128.6,10.49 v122.6,10.49 122.6,2.86 159.72,2.86 159.72,0.85 176.04,0.85 176.92,1.73 176.92,3.61 | v176.57,3.25 176.92,3.61
  Bottom 0.406: D37.C arc-90 177.49,41.01 177.49,35.09 v172.59,30.19 172.42,30.02 D31.C | v167.85,30.04 169.01,30.04 169.38,29.67 169.38,24.45 169.2,24.27 168.09,24.27 D40.C 167.85,24.04 v167.85,21.85 | D43.C 173.71,21.6 173.43,21.88 172.03,21.88 v172,21.85 | D35.C 122.44,10.65 v122.6,10.49 | v128.66,10.42 D26.C | D26.C | D26.C 132.85,23.63 D24.C 122.86,23.95 120.95,25.85 D28.C | IC3.13 142.95,11.68 144.22,10.4 146.71,10.4 R23.1 146.72,7.66 149.51,7.66 151.07,6.1 152.58,6.1 153.57,5.11 163.06,5.11 164.92,3.25 v176.57,3.25
EDOUT
  Bottom 0.406: IC3.17 137.87,25.61 138.32,26.06 146.15,26.06 148.36,28.28 151.54,28.28 TX.DATA
EOSC1
  Bottom 0.406: R24.2 139.14,18.6 IC3.16
EOSC2
  Bottom 0.406: R24.1 140.41,18.91 IC3.15
FAN_ON/OFF
  Top 0.406: ATMEGA32U4.30 135.88,77.95 136.52,77.31 136.52,60.8 135.84,60.12 134.17,60.12 RN1.8
  Top 1.016: CN2.8 134,60.07 RN1.8
FAN_REG
  Bottom 0.813: U$7.1 124.41,106.58 124.56,106.73 170.31,106.73 170.75,106.3 170.75,101.37 171.88,100.23
  Bottom 1.27: U$5.1 159.16,92.71 176.72,92.71 | 176.72,92.71 179.37,90.06 179.37,81.67 178.28,80.58 R12.1 | LOAD_CN.8 105.22,106.68 111.65,106.68 113.46,104.87 U$7.1 | 176.72,92.71 175.04,94.39 175.04,98.55 173.35,100.23 171.88,100.23 159.26,100.23 159,100.5 U$9.1
  Bottom 1.422: 165.63,83.68 165.27,84.04 T4.T1
  Bottom 2.184: 175.03,73.93 R12.1 174.94,80.67 R13.1 166.42,83.68 165.63,83.68 | 175.03,73.93 R10.1 | R11.1 173.51,72.41 175.03,73.93
GND  (via drill 0.8 pad 1.27)
  Top 0.305: ATMEGA32U4.43 122.21,80.35 121.92,80.07 121.92,78.92 | ATMEGA32U4.15 123.81,72.47 124.24,72.9 124.24,75.2 124.85,75.81 128.03,75.81 128.51,76.29 | 89.1,64 89.29,64.19
  Top 0.406: ATMEGA32U4.43 122.19,82.17 122.19,82.66 122.19,83.44 120.44,85.19 120.44,89.46 119.75,90.15 119.75,90.25 | ATMEGA32U4.33 131.21,81.42 | 131.21,81.42 131.21,82.94 130.78,83.37 128.82,83.37 128.64,83.19 128.64,82.18 ATMEGA32U4.35 128.61,81.22 127.65,80.26 127.65,78.71 | v132.48,81.84 131.63,81.84 131.21,81.42 | 121.92,78.92 122.34,78.5 | 122.34,78.5 127.44,78.5 127.65,78.71 | 127.65,78.71 128.51,77.85 128.51,76.29 128.51,73.32 129.48,72.35 ATMEGA32U4.23 131.21,70.85 v131.57,70.49 | 122.34,78.5 120.99,77.15 ATMEGA32U4.5 119.58,77.18 116.66,77.18 116.11,77.73 | 116.11,77.73 C7.1 116.1,80.05 116.1,82.09 115.72,82.47 112.34,82.47 111.44,81.57 111.44,77.47 113.23,75.69 JP1.6 110.8,75 OK2.2 104.72,72.61 104.12,72.01 104.12,65.15 | 116.11,77.73 115.99,77.73 115.99,77.74 | 92.51,72.44 OK1.2
  Top 0.61: 119.75,90.25 119.75,90.44 | 119.75,90.44 119.75,93.33 120.39,93.98 136.22,93.98 138.87,91.32 146.82,91.32 147.54,90.6 147.54,90.51 147.57,90.48 147.57,86.52 v147.39,86.34 | C6.2 119.94,90.25 119.75,90.44
  Top 0.813: 8.6,83.86 C5.C arc-90 7.98,83.24 LED2.C | 8.6,83.86 C4.C | 13.49,81.49 13.18,81.18 U$3.GND 13.18,77.57 14.21,76.54 19.34,76.54 LED1.C 23.36,79.54 C3.2 22.68,76.31 D1.A 21.8,72.01 C1.- 21.8,62.23 22.83,61.2 29.49,61.2 30.78,62.5 | 13.49,81.49 15.35,83.35 IC1.1 | 8.6,83.86 10.96,81.49 13.49,81.49 | B1.- 30.78,77.74 30.78,62.5 | 149.42,76.51 149.42,85.63 149.15,85.91 149.2,85.91 149.24,85.95 147.78,85.95 v147.39,86.34 145.05,86.34 OK7.2 | 149.42,76.51 149.42,67.14 | 149.42,67.14 149.42,57.02 149.07,56.67 144.94,56.67 OK4.2 | OK5.2 148.65,66.36 149.42,67.14 | OK6.2 149.11,76.2 149.42,76.51 | Q2.2 123.04,90.25 C6.2 | C18.2 116.1,90.25 C19.1 119.75,90.25 | v73.88,76.54 74.33,76.09 v80.42,76.09 | OK8.2 89.29,64.19 88.84,64.64 88.84,68.08 | 88.84,68.08 88.84,71.9 89.38,72.44 92.51,72.44 | v86.43,66.95 87.72,66.95 88.84,68.08 | U$2.GND@1 64.46,56.57 64.8,56.91 88.55,56.91 89.1,57.46 89.1,64 | 30.78,62.5 35.81,67.52 46.3,67.52 48.9,64.93 SMPS_5V@2A.4 | v104.39,59.16 104.12,59.42 104.12,65.15 105.04,64.23 OK3.2 111.39,64.23 v113.81,66.4
  Bottom 0.305: CN2.1 116.22,54.67 116.12,54.77 | C8.1 113.76,66.16 v113.81,66.4
  Bottom 0.406: S1.1 149.71,91.27 149.63,91.18 | IC2.9 133.21,82.47 v132.48,81.84 | v131.57,70.49 133.1,68.96 C9.1 | X1.2 21.8,56.52 C1.- | JP1.6 110.39,75 Q5.2 104.51,79.26 101.15,79.26 98.66,76.77 90.93,76.77 Q4.2 87.1,80.34 86.27,79.51 83.84,79.51 v80.42,76.09 | Q3.2 73.88,78.33 v73.88,76.54 | Q6.2 80.95,63.6 | 116.12,54.77 114.37,56.52 104.91,56.52 104.39,57.05 v104.39,59.16
  Bottom 0.61: 80.95,63.6 80.95,66.17 81.73,66.95 | 81.73,66.95 v86.43,66.95 | v86.43,66.95 86.64,67.17 | v80.42,76.09 80.42,68.27 81.73,66.95 | U$1.4 88.38,65 v86.43,66.95
  Bottom 0.813: 149.63,91.18 149.63,88.89 S1.2 149.65,88.8 149.63,88.82 149.63,86.35 S1.3 149.66,86.22 149.65,86.22 | S1.8 S1.7 S1.6 149.7,78.66 149.7,81.15 149.71,81.17 S1.5 S1.4 149.57,83.87 149.57,86.25 149.6,86.22 149.65,86.22 | 149.65,86.22 149.74,86.31 147.42,86.31 v147.39,86.34
  Bottom 1.27: U$2.GND@1 50.82,54.68 48.94,56.56 48.94,63.51 SMPS_5V@2A.4
  pour Bottom (isolate 0.813): 0.03,107.77 0.03,51.27 180.8,51.27 180.8,107.78 0.02,107.78
  pour Top (isolate 0.813): 0.16,107.69 0.16,51.28 180.74,51.28 180.74,107.7 0.15,107.7
GNDA  (via drill 0.8 pad 1.27)
  Top 0.406: v148.75,25.81 148.75,29.89 148.99,30.13 151.35,30.13 TX.GND | v140.36,47.89 142.53,47.89 143.32,48.67 169.86,48.67 | 169.86,48.67 176.41,48.67 178.13,46.95 178.13,36.54 176.97,35.38 165.46,35.38 v164.54,34.46 | v169.05,46.71 169.05,47.86 169.86,48.67 | v141.01,23.43 141.01,27.61 v140.39,27.61
  Bottom 0.406: R23.2 149.54,12.69 R22.2 149.51,15.05 R21.2 R9.2 149.57,25 v148.75,25.81 | VBAT.2 112.9,32.94 113.59,33.63 119,33.63 119.36,33.99 119.36,39.71 118.28,40.79 118.28,47.44 119.62,48.77 139.47,48.77 v140.36,47.89 | v164.54,34.46 161.38,31.29 152.51,31.29 TX.GND 147.19,30.7 IC3.9 146.72,30.23 146.72,28.35 145.98,27.61 v140.39,27.61 | S3.1 S3.2 S3.3 S3.4 S3.5 S3.6 S3.7 S3.8 167.2,46.71 v169.05,46.71 | IC3.14 141.68,23.43 v141.01,23.43
  pour Bottom (isolate 0.61): 178.88,49.74 104.53,49.74 arc90 101.03,46.24 101.03,2.94 arc90 103.99,-0.02 178.29,-0.02 arc90 180.81,2.5 180.81,47.74 arc90 178.83,49.73
LEVEL1
  Top 0.406: ATMEGA32U4.31 136.38,78.75 137.32,77.81 137.32,58.81 138.22,57.91 141.45,57.91 R27.1
LEVEL2
  Top 0.406: ATMEGA32U4.32 136.78,79.55 138.29,78.04 138.29,67.46 138.81,66.95 141.56,66.95 R29.1
LEVEL3
  Top 0.406: R31.1 139.5,76.51 139.05,76.96 139.05,78.54 137.31,80.27 134.67,80.27 134.43,80.51 134.43,83.54 133.9,84.08 128.1,84.08 127.8,83.77 ATMEGA32U4.36
LEVEL4
  Top 0.406: ATMEGA32U4.37 127.01,84.31 127.48,84.78 139.89,84.78 R33.1
LINE
  Top 1.016: 102.8,86.53 103,86.33 | 171.46,88.2 171.04,88.2
  Top 1.27: K2.C 86.63,77.49 86.63,84.85 87.99,86.21 | 87.99,86.21 88.31,86.53 102.8,86.53 110.52,86.53 111.7,87.71 111.7,90.3 122.45,101.06 | 103,86.33 K3.C | 87.99,86.21 87.7,86.5 71.96,86.5 70.04,84.58 K1.C 70.04,65.77 71.07,64.74 76.99,64.74 K4.C | LOAD_CN.1 64.75,104.95 65.45,105.65 102.56,105.65 107.15,101.06 122.45,101.06 | 122.45,101.06 129.83,101.06 131.7,102.93 131.7,106.22 132.25,106.76 160.8,106.76 164.08,103.48 164.08,97.35 169.88,91.55 169.88,89.78 171.46,88.2 | 171.04,88.2 R13.2
  Bottom 1.422: 166.81,64.15 166.75,64.2 T2.T2
  Bottom 1.676: F1.1 26.16,90.83 27.58,92.25 27.58,102.16 | 27.58,102.16 R1.2 | 27.58,102.16 29.21,100.54 SMPS_5V@2A.1 37.64,100.54 41.29,104.2 61.78,104.2 LOAD_CN.1
  Bottom 1.778: R34.2 161.09,80.28 161.09,75.36 | R32.2 161.04,72.24 161.04,64.2
  Bottom 1.93: R34.2 161.33,86.58 T4.T2 | R32.2 158.14,75.36 161.09,75.36 T3.T2 | R30.2 159.58,64.2 161.04,64.2 T2.T2 | R28.2 161.28,58.66 163.79,58.66 | 163.79,58.66 165.65,56.8 T1.T2 | 163.79,58.66 166.39,58.66 168.9,61.18 168.9,63.97 168.73,64.15
  Bottom 2.184: T4.T2 169.25,86.58 R13.2 171.04,88.2 R12.2 | R10.2 175.02,64.79 R11.2 168.73,64.15 166.81,64.15
LOAD_1
  Top 1.27: K4.NO 66.91,74.85 66.91,87.94 74.47,95.5 75.97,95.5 79.74,99.27 LOAD_CN.4
LOAD_2
  Top 1.422: K1.NO 84.77,100.33 LOAD_CN.5
LOAD_3
  Top 1.422: K2.NO 89.77,94.3 LOAD_CN.6
MISO  (via drill 0.8 pad 1.27)
  Top 0.254: 114.5,71.21 114.5,68.77
  Top 0.305: JP1.3 114.5,71.21 | v105.2,66.27 105.22,66.27 105.77,65.72 111.46,65.72 114.5,68.77
  Top 0.406: ATMEGA32U4.11 115.87,72.35 JP1.3
  Top 0.813: R20.1 101,58.7 102.75,60.44 v102.75,66.48
  Bottom 0.305: v105.2,66.27 104.99,66.48 v102.75,66.48
MOSI  (via drill 0.8 pad 1.27)
  Top 0.406: ATMEGA32U4.10 117.33,73.15 117,73.49 117,73.77 JP1.5 | R19.1 110.69,57.79 v112.32,57.79 | 137.47,55.18 137.5,55.22
  Top 0.813: v136.21,56.44 137.47,55.18 | 137.5,55.22 v141.5,55.22
  Bottom 0.305: 126.74,75.74 123.84,75.74 122.75,74.65 116.12,74.65 JP1.5
  Bottom 0.406: v112.32,57.79 112.68,57.43 135.89,57.43 136.21,57.12 v136.21,56.44 | v141.5,55.22 142,55.72 142,71.55 141.34,72.21 138.9,72.21 135.37,75.74 126.74,75.74
N$1
  Top 0.813: R31.2 144.38,79.31 OK6.1
N$2
  Top 0.813: R27.2 143.26,60.74 OK4.1
N$3
  Top 0.813: R29.2 143.91,69.79 OK5.1
N$4
  Top 1.93: OK4.6 157.94,59.14 R28.1
N$5
  Top 0.813: R33.2 144.26,89.26 OK7.1
N$6
  Top 0.813: U$3.UART_TX 8.68,62.79 R4.2
N$7
  Top 0.406: ATMEGA32U4.6 114.43,76.35 113.34,77.44 113.34,80.01 C7.2
N$8
  Top 0.406: Q2.1 125.51,90.85 R14.1
N$9
  Top 0.813: R3.1 5.18,86.43 arc90 LED2.A
N$10
  Top 0.406: ATMEGA32U4.42 122.98,82.18 122.98,83.66 121.81,84.83 121.81,87.23 C6.1
N$11
  Top 0.813: U$3.UART_RX 11.68,63.66 R5.2
N$12
  Bottom 0.61: U$1.1 95.45,61.19 Y1.1
N$13
  Bottom 0.61: Y1.2 96.23,62.46 U$1.2
N$14  (via drill 0.8 pad 1.27)
  Top 0.813: v73.99,58.74 69.92,58.74 62.26,66.39 59.99,66.39 59.66,66.72 v58.26,66.72
  Bottom 0.406: U$1.3 102.88,63.73 | v58.26,66.72 58.31,66.67
  Bottom 0.61: U$1.3 102.6,63.73 102.95,63.38 102.95,61.38 103.17,61.16 105.75,61.16 U$1.8 105.78,61.29 R7.1 R8.1
  Bottom 0.813: 102.88,63.73 102.88,58.7 101.27,57.09 75.64,57.09 v73.99,58.74 | 58.31,66.67 D3.C
  Bottom 1.27: D2.C 58.31,59.73 D3.C
N$15
  Top 0.813: R2.2 26.04,80.36 LED1.A
N$16
  Bottom 1.27: B1.+ 54.71,81.61 D3.A
N$17  (via drill 0.8 pad 1.27)
  Top 0.406: 158.07,44.88 160.42,44.88 v160.42,43.05
  Bottom 0.406: v160.42,43.05 170.8,43.05 170.8,44.51 171.18,44.89 D12.A
N$18  (via drill 0.8 pad 1.27)
  Top 0.406: v156.96,29.84 156.96,28.84 158.05,27.76
  Bottom 0.406: D13.A 156.91,29.79 v156.96,29.84
N$21
  Top 0.406: 0,107.71 0,79.58 5.66,79.58 5.66,66.07 0.03,66.07 0.03,51.27 180.88,51.27 180.88,107.73 0,107.73
N$22  (via drill 0.8 pad 1.27)
  Top 0.406: ATMEGA32U4.16 124.61,70.6 124.57,70.64 124.57,68.53 v124.46,68.46
  Bottom 0.406: v124.46,68.46 122.29,66.16 Q1.2 | 120.22,66.19 119.57,66.85 C8.2
  Bottom 1.422: Q1.2 120.22,66.19
N$23  (via drill 0.8 pad 1.27)
  Top 0.406: 125.49,70.79 125.41,70.71 ATMEGA32U4.17 125.4,70.56 | 125.4,70.56 125.4,70.6 | 125.4,70.56 125.4,69.49 125.92,68.97 125.92,67.08 v126.09,66.94
  Bottom 0.406: v126.09,66.94 126.83,66.16 Q1.1
  Bottom 1.422: Q1.1 C9.2
N$24
  Top 0.406: Q2.3 127.85,88.49 R15.1
N$25
  Bottom 0.406: 0.1,107.74 0.1,79.53 5.67,79.53 5.67,65.9 -0.03,65.9 -0.03,51.24 180.86,51.24 180.86,107.74 0.06,107.74
N$26
  Bottom 0.406: VBAT.1 104.13,29.68 104.13,6.41 108.84,1.71 151.65,1.71 152.79,2.85 S2.2
N$27
  Top 0.406: R15.2 134.05,88.16 LED3.C
N$28  (via drill 0.8 pad 1.27)
  Top 0.406: v175.66,6.53 172.47,9.72 172.47,13.24 168.15,17.56 v154.15,17.48
  Bottom 0.406: S2.3 155.79,1.69 159.98,1.69 159.98,0.72 177.11,0.72 178.55,2.17 178.55,6.13 178.15,6.53 v175.66,6.53 | v154.15,17.48 154.18,19.7 154.18,23.78 152.34,25.62 TX.VCC
N$29
  Top 1.93: OK5.6 157.41,68.9 R30.1
N$30
  Top 1.93: OK6.6 157.71,78.74 R32.1
N$31
  Bottom 1.422: U$2.ANT 105.17,54.35 105.4,54.35 105.43,54.38 ANT1.1
N$32  (via drill 0.8 pad 1.27)
  Top 0.406: 83.24,72.71 OK1.3
  Top 0.61: 80.96,82.26 80.96,82.28
  Top 0.813: v73.74,82.28 80.96,82.28 | 83.24,72.71 83.16,72.78 83.16,80.05 80.96,82.26
  Bottom 0.406: Q3.1 72.06,82.28 v73.74,82.28
N$33  (via drill 0.8 pad 1.27)
  Top 0.61: OK1.4 73.87,70.03 v72.43,71.47
  Bottom 0.61: v72.43,71.47 64.5,79.4 K1.2
  Bottom 1.016: Q3.3 65.85,81.22 K1.2 64.15,79.51 64.15,86.25 64.68,86.79 D5.A
N$34
  Top 2.184: OK7.6 156.52,88.67 R34.1
N$35  (via drill 0.8 pad 1.27)
  Top 0.406: v162.37,6.74 159.42,6.74 159.36,6.69
  Bottom 0.406: v162.37,6.74 162.31,6.69 D15.A 157.08,6.69 D14.A
N$36
  Bottom 1.676: AC.1 7.03,95.91 F1.2
N$37
  Bottom 1.016: D5.C D4.C
N$39
  Bottom 0.406: 101.06,3.03 101.06,46.35 arc-90 104.48,49.77 178.48,49.77 arc-90 180.82,47.44 180.82,2.55 arc-90 178.26,0 103.95,0 arc-90 100.98,2.97
N$40  (via drill 0.6, 0.8 pad 1.27)
  Top 0.406: v152.69,14.07 155.22,11.53 157.96,11.53 158.14,11.71 163.02,11.71 164.63,10.1 v164.63,6.95 | v167.98,4.69 166.02,2.74 ANT2.1
  Bottom 0.406: TX.ANT 151.66,15.1 v152.69,14.07 | v164.63,6.95 166.89,4.69 v167.98,4.69
N$41
  Top 0.406: OK1.1 92.65,68.86 R17.2
N$42  (via drill 0.8 pad 1.27)
  Top 0.406: 146.09,45.25 144.83,45.25 v144.83,47.06
  Bottom 0.406: v144.83,47.06 144.81,47.06 D16.A
N$43  (via drill 0.8 pad 1.27)
  Top 0.406: 98.94,81.81 99.66,81.09 99.66,73.39 OK2.3
  Top 0.813: v89.97,81.81 98.94,81.81
  Bottom 0.406: Q4.1 89.54,82.24 v89.97,81.81
N$44  (via drill 0.8 pad 1.27)
  Top 0.406: v179.2,31.94 178.64,32.71 146.66,32.71 146.22,32.26 146.22,27.81
  Bottom 0.406: D18.A 141.07,45.31 D17.A 143.1,47.28 143.1,48.08 143.48,48.46 146.79,48.46 147.13,48.81 177.62,48.81 179.16,47.26 v179.2,31.94
N$45  (via drill 0.8 pad 1.27)
  Top 0.61: OK2.4 98.87,70.06 94.69,70.06 94.79,70.15 94.79,75.52 94.45,75.18 85.01,75.18 84.43,75.77 84.43,82.66 82.62,84.47 v81.32,84.47
  Bottom 0.61: v81.32,84.47 80.5,83.65 K2.2
  Bottom 1.016: K2.2 82.42,81.29 82.54,81.29 | 82.54,81.29 Q4.3 | D7.A 82.54,82.07 82.54,81.29
N$46
  Bottom 1.016: D6.C 88.47,86.76 D7.C
N$48  (via drill 0.8 pad 1.27)
  Top 0.406: v148.54,6.45 147.41,6.62 147.3,6.51
  Bottom 0.406: D20.A 141.31,6.66 D19.A 148.54,6.68 v148.54,6.45
N$49  (via drill 0.8 pad 1.27)
  Top 0.406: 133.77,45.37 134.24,45.83 v134.24,46.96
  Bottom 0.406: D21.A 136.76,45.16 D22.A | D23.A 131.94,45.16 D22.A | v134.24,46.96 134.34,46.86 D22.A
N$50
  Top 0.406: OK2.1 108.42,68.7 R18.2
N$51  (via drill 0.8 pad 1.27)
  Top 0.406: OK3.3 102.59,67.97 102.59,72.98 | 106.78,80.73 106.96,80.91
  Top 0.813: 102.59,72.98 106.78,77.17 106.78,80.73 | 106.96,80.91 v106.96,82.12
  Bottom 0.813: v106.96,82.12 106.81,81.97 Q5.1
N$52  (via drill 0.8 pad 1.27)
  Top 0.406: v122.17,47.22 122.34,47.22 122.34,45.35
  Bottom 0.406: D28.A 120.95,45.27 D27.A 122.17,45.27 v122.17,47.22
N$53  (via drill 0.8 pad 1.27)
  Top 0.61: OK3.4 96.39,61.69 96.39,66.39 99.1,66.39 101.41,68.7 101.41,75.45 100.67,76.2 100.67,80.86 v100.82,81.02
  Bottom 1.016: K3.2 98.65,81.02 v100.82,81.02 | v100.82,81.02 Q5.3 | D9.A 100.82,82.72 100.82,82.02 v100.82,81.02
N$54
  Top 1.93: OK4.4 155.87,54.06 157.12,52.81 162.18,52.81 162.94,53.57 162.94,55.08 T1.G
N$55
  Top 1.27: T1.T1 174.76,61.82 178.04,61.82 179.4,63.18 179.4,96.4 178.84,96.96 C14.1
  Bottom 1.27: U$4.2 171.21,97.39 C14.1
N$56
  Bottom 1.27: U$5.2 154.97,94.17 U$4.1 154.54,96.96 C14.2
N$57
  Bottom 1.016: D8.C 106.14,86.85 D9.C
N$59  (via drill 0.8 pad 1.27)
  Top 0.406: v169.01,12.91 v160.18,12.91 160.14,12.95 160.14,15.99 159.61,16.52 155.92,16.52 154.39,14.98 v141.33,14.98 139.51,16.81 v131.55,16.81 | v123.48,38 133.88,38 v133.88,38.03 | v123.59,26.58 119.42,26.58 v119.38,26.62 | v119.55,12.24 126.85,12.24 v126.89,12.29
  Bottom 0.406: D30.C 178.06,10.07 176.63,8.63 169.07,8.63 168.96,8.74 168.96,10.44 | 168.96,10.44 D41.C | 168.96,10.44 168.96,12.86 v169.01,12.91 | D15.C 160.18,10.54 v160.18,12.91 157.86,12.91 156.91,13.85 D13.C | D27.C 123.48,41.45 v123.48,38 123.48,26.68 v123.59,26.58 | v133.88,38.03 134.34,38.49 D22.C | v119.38,26.62 119.38,12.41 v119.55,12.24 | D33.C v126.89,12.29 126.89,16.35 127.33,16.79 131.52,16.79 v131.55,16.81 | v141.33,14.98 D19.C
N$60  (via drill 0.8 pad 1.27)
  Top 0.406: 177.5,28.46 177.5,29.94 v177.47,29.94
  Bottom 0.406: D30.A 177.47,27.85 v177.47,29.94 177.47,28.72 176.82,28.07 176.82,25.36 D29.A 175.45,24.26 D31.A
N$61  (via drill 0.8 pad 1.27)
  Top 0.406: 133.81,27.74 132.65,27.74 v132.65,29.82
  Bottom 0.406: v132.65,29.82 132.53,29.82 D24.A
N$62
  Top 1.93: OK5.4 155.46,63.82 156.14,63.15 160.35,63.15 160.84,63.63 160.84,66.1 161.37,66.64 163.8,66.64 T2.G
N$63
  Top 1.27: 166.51,61.66 166.46,61.72 166.46,67.72 167.5,68.76 173.08,68.76 173.64,69.32 173.64,78.28 172.27,79.64 172.27,85.15 173.7,86.58 173.7,90.29 168.75,95.25 168.75,102.51 168.05,103.21 C15.1
  Top 1.422: T2.T1 166.51,61.66
  Bottom 1.016: 167.67,103.72 168.05,104.1 C15.1
  Bottom 1.27: 167.67,103.72 U$6.2
N$64
  Bottom 1.27: U$7.2 130.76,101.32 139.31,101.32 140.61,102.62 C15.2 154.43,104.26 U$6.1
N$65
  Top 0.813: OK3.1 108.38,60.05 R19.2
N$66  (via drill 0.8 pad 1.27)
  Top 0.406: OK8.3 82.99,64.3
  Top 0.813: 82.99,64.3 82.99,67.62 82.6,68.01 80.86,68.01 80,68.88 76.7,68.88 v75.94,68.12
  Bottom 0.406: v75.94,68.12 Q6.1
N$67
  Top 1.016: OK8.4 77.9,61.65 K4.2
  Bottom 1.016: Q6.3 72.71,64.55 | 72.71,64.55 D11.A | K4.2 73.23,60.49 72.63,61.1 72.63,64.47 72.71,64.55
N$68  (via drill 0.8 pad 1.27)
  Top 0.406: 169.99,44.91 170.55,45.47 170.55,46.85 171.12,47.42 174.88,47.42 175.02,47.28 v175.02,46.43 175.03,46.42 175.13,46.42
  Bottom 0.406: v175.02,46.43 175.09,46.35 D36.A D37.A
N$69
  Bottom 1.016: D10.C D11.C
N$70
  Top 1.93: OK6.4 155.57,73.66 156.57,72.66 160.3,72.66 160.75,73.11 160.75,77.27 161.31,77.84 163.77,77.84 T3.G
N$71
  Top 1.016: 166.35,79.16 166.35,92.73 163.86,95.22 148.9,95.22
  Top 1.27: T3.T1 166.61,72.82 166.82,73.03 166.82,78.7 166.35,79.16 | 148.9,95.22 146.41,92.73 140.57,92.73 140.18,93.12 140.18,96.48 C17.1 136.56,100.41 C16.1
  Bottom 1.27: U$8.2 129.09,96.64 C17.1
N$72
  Bottom 1.27: C17.2 114.97,98.7 U$8.1 124.19,98.73 124.19,101.02 124.66,101.49 127.73,101.49 129.73,99.49 141.22,99.49 141.98,100.25 154.75,100.25 U$9.2
  Bottom 1.422: C16.2 112.9,100.31 C17.2
N$74  (via drill 0.8 pad 1.27)
  Top 0.406: v137.05,6.62 135.39,6.62 135.29,6.73
  Bottom 0.406: v137.05,6.62 137.03,6.61 D25.A 135.17,6.62 D26.A
N$75  (via drill 0.8 pad 1.27)
  Top 0.406: 162.52,23.35 163.69,23.35 v163.69,22.06
  Bottom 0.406: D40.A 165.97,28.05 D39.A 165.95,26.43 D38.A 163.75,22.06 v163.69,22.06
N$76  (via drill 0.8 pad 1.27)
  Top 0.406: MASTER.2 117.85,22.35 v122.38,22.35
  Bottom 0.406: v122.38,22.35 122.44,22.29 D35.A 122.52,18.32 D32.A 124.67,18.3 D33.A 126.98,18.39 D34.A
N$77
  Top 0.813: OK8.1 92.64,60.13 R20.2
N$78
  Top 1.778: 155.53,81.31 160.34,81.31 160.5,81.47 160.5,87.94 161.53,88.98 163.58,88.98 T4.G
  Top 1.93: OK7.4 154.13,82.7 155.53,81.31
N$79  (via drill 0.8 pad 1.27)
  Top 0.406: 171.23,6.66 171.23,4.66 v171.29,4.66
  Bottom 0.406: D43.A D42.A | D42.A 171.38,6.68 D41.A | v171.29,4.66 171.29,6.77 D42.A
N$80
  Top 0.406: 104.44,49.77 178.54,49.77 arc-90 180.88,47.43 180.88,2.64 arc-90 178.19,-0.05 103.89,-0.05 arc-90 100.98,2.85 100.98,46.25 arc-90 104.48,49.75
N$83  (via drill 0.8 pad 0.81, 0.8 pad 1.27)
  Top 0.305: v97.48,67.71 97.13,67.27 R17.1 | ATMEGA32U4.8 121.83,74.75 122.57,75.49 v122.57,76.17
  Bottom 0.254: 114.49,76.1 114.49,74.3 | 114.05,73.73 112.06,73.73
  Bottom 0.305: 114.49,76.1 114.75,76.34 116.67,76.34 117.7,75.31 121.71,75.31 v122.57,76.17 | 114.49,74.3 114.05,73.73 | 112.06,73.73 105.95,67.57 v97.48,67.71
NEUTRAL
  Top 1.676: SMPS_5V@2A.2 45.54,100.54 41.8,96.79 24.1,96.79 R1.1
  Bottom 1.676: AC.2 21.86,96.99 23.61,96.99 R1.1 | SMPS_5V@2A.2 57.58,100.54 61.39,96.73 71.89,96.73 72.21,97.05 72.21,98.69 | 72.21,98.69 LOAD_CN.3 | LOAD_CN.2 69.76,101.14 72.21,98.69
OSC1
  Bottom 0.406: IC2.16 123.58,90.09 R16.1
OSC2
  Bottom 0.406: IC2.15 122.05,88.82 R16.2
PLUG_CONTROL
  Top 1.422: K3.NO 104.75,95.82 95.54,95.82 94.75,96.6 LOAD_CN.7
RX  (via drill 0.8 pad 1.27, 0.8 pad 1.42)
  Top 0.406: R5.1 13.45,59.09 | ATMEGA32U4.21 128.61,69.58 v130.02,68.16
  Top 0.813: v137.89,53.83 136.97,52.25 50.16,52.25 43.32,59.09 13.45,59.09
  Bottom 0.406: v130.02,68.16 130.59,67.6 137.39,67.6 138.01,66.98 v137.89,53.83
SCK  (via drill 0.8 pad 1.27)
  Top 0.305: v121.72,72.96 121.72,73.95 ATMEGA32U4.9
  Top 0.406: JP1.4 110.77,70 110.77,68.31 109.86,67.4 R18.1
  Bottom 0.305: JP1.4 114.95,73.72 116.71,73.72 117.4,73.03 121.3,73.03 v121.72,72.96
SCL  (via drill 0.8 pad 1.27)
  Top 0.305: v126.5,73.43 126.21,73.14 ATMEGA32U4.18
  Bottom 0.305: 124.79,66.93 124.79,67.24 126.16,68.61 126.16,73.09 v126.5,73.43
  Bottom 0.406: R7.2 110.57,62.66 124.79,62.66 124.79,66.93
  Bottom 0.61: R7.2 110.57,63.73 U$1.6
SDA  (via drill 0.8 pad 1.27)
  Top 0.305: v125.43,74.74 127.13,74.74 127.58,74.3 127.58,72.62 127.01,72.06 ATMEGA32U4.19
  Bottom 0.406: v125.43,74.74 124.54,74.74 124.47,74.68 124.47,70.44 122.5,68.47 114.07,68.47 113.65,68.04 108.28,68.04 106.79,66.56 106.79,66.08 | 106.79,66.08 106.79,65.03 | 106.79,65.03 106.82,65 | 106.79,65.03 106.79,65 106.82,64.97 105.8,64.97 U$1.5 | R8.2 112.82,64.31 112.82,65.47 112.21,66.08 106.79,66.08
  Bottom 0.61: 113.03,64.09 R8.2
SW-1
  Top 0.406: RN1.2 118.87,62.6 122.04,65.78 129.08,65.78 129.42,66.11 132.21,66.11 132.29,66.19 132.29,67.67 ATMEGA32U4.22
  Top 1.016: CN2.2 118.76,60.07 RN1.2
SW-2
  Top 0.406: ATMEGA32U4.25 132.89,73.95 133.03,73.75 133.03,65.54 132.53,65.03 132.39,65.03 132.35,65.06 123.63,65.06 121.44,62.88 121.44,60.2 RN1.3
  Top 1.016: CN2.3 121.3,60.07 RN1.3
SW-3
  Top 0.406: 131.27,74.77 131.25,74.75 ATMEGA32U4.26 133.28,74.75 133.68,74.36 133.68,65.02 133.07,64.42 133.05,64.42 132.99,64.37 125.17,64.37 123.92,63.12 123.92,60.21 RN1.4
  Top 1.016: CN2.4 123.84,60.07 RN1.4
SW-4
  Top 0.406: ATMEGA32U4.27 134.07,75.55 134.35,75.27 134.35,64.3 133.74,63.69 133.72,63.69 133.7,63.72 127.26,63.72 126.5,62.96 RN1.5
  Top 1.016: CN2.5 126.38,60.07 RN1.5
TX  (via drill 0.8 pad 1.27)
  Top 0.406: ATMEGA32U4.20 127.83,70.58 127.83,68.49 v128.11,68.21 | v12.29,55.47 9.22,58.53 R4.1
  Bottom 0.406: v128.11,68.21 128.11,71.85 128.91,72.65 136.28,72.65 139.33,69.61 139.33,52.8 138.43,51.91 137.17,51.91 136.69,52.39 71.78,52.39 71.51,51.97 15.35,51.98 12.29,55.31 v12.29,55.47
UP
  Top 0.406: ATMEGA32U4.28 134.75,76.35 135,76.1 135,63.49 134.49,62.98 130.08,62.98 129.04,61.94 129.04,60.19 RN1.6
  Top 1.016: CN2.6 128.92,60.07 RN1.6
V+  (via drill 0.8 pad 1.27)
  Top 0.406: 135.12,39.29 125.23,39.29 0.1 | 135.12,40.92 7.1 135.04,39.38 135.12,39.29 | 135.12,39.29 135.12,39.28 | 135.12,39.28 147.27,39.28 147.27,39.3 | 147.27,39.3 147.27,40.8 4.1 | 147.27,39.3 159.35,39.3 | 159.35,39.3 1.1 | 159.35,39.3 159.35,39.25 171.05,39.25 171.26,39.46 F_ON.1 | MASTER.1 107.65,25.75 107.38,25.48 107.38,19.9 108.13,19.16 113.97,19.16 114.28,19.47 129.34,19.47 | 134.02,7.37 134,7.37 134,7.36 130.13,7.36 130.13,4.69 142.22,4.69 | 142.22,4.69 142.22,7.14 | 154.28,7.32 154.28,4.69 | 154.28,4.69 142.22,4.69 | 166.15,7.29 166.15,4.69 154.28,4.69 | 8.1 135.08,19.47 | 135.63,19.47 147.15,19.47 147.15,19.57 | 147.15,19.57 147.15,23.36 5.1 | 147.15,19.57 159.32,19.57 159.32,27.13 159.32,28.43 163.15,28.43 | DOWN.1 172.01,23.38 UP.1 | 129.34,19.47 135.08,19.47 | 9.1 130.21,18.6 129.34,19.47 | 135.12,39.28 135.12,27.15 135.08,27.11 | v136.55,18.55 135.63,19.47 | 135.63,19.47 135.08,19.47
  Bottom 0.406: IC3.18 136.55,21.24 v136.55,18.55
  pour Top (isolate 0.61): 178.73,49.79 104.7,49.79 arc90 101,46.09 101,2.92 arc90 103.89,0.04 178.36,0.04 arc90 180.81,2.49 180.81,47.66 arc90 178.69,49.78

## Text on the board
Top: HBT Vr2 | TOP SIDE | TOP
Bottom: Made In India | BOT SIDE | BOT | HBT
bPlace: 3.3V Battery
tNames: ICSP